# Altium project RTTester_CIV.PrjPcb (part 2 of 2)

## Sheet EEPROM.SchDoc: EEPROM
size A4; DocumentNumber: 5; SheetNumber: 5; SheetTotal: 18
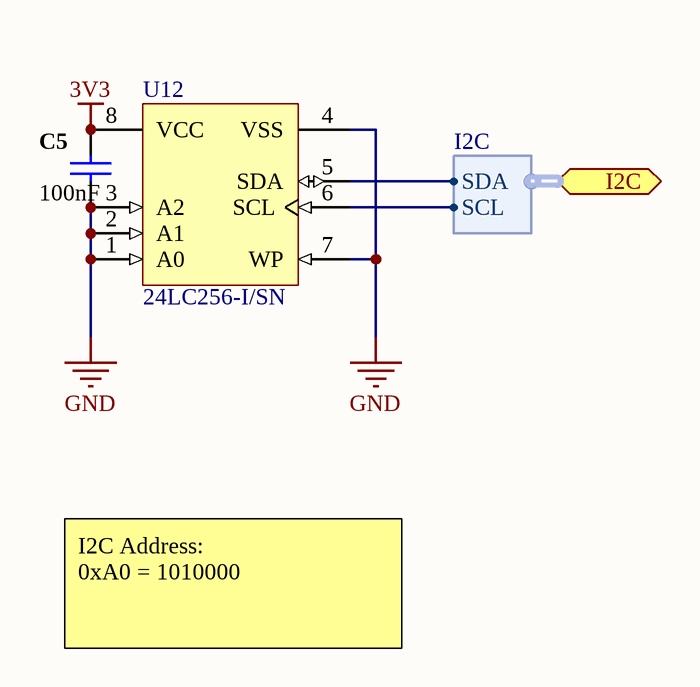
[diagram p17: EEPROM.SchDoc]

### Parts
C5  100nF  [0805C-GENERIC]
U12  24LC256-I/SN  [SOIC-SN8_L]

### Ports
I2C (harness I2C)

### Harnesses
I2C: SDA, SCL

### Nets
3V3: C5.1 U12.8(VCC)
GND: C5.2 U12.1(A0) U12.2(A1) U12.3(A2) U12.4(VSS) U12.7(WP)
FPGA_SCL: U12.6(SCL) ; port I2C.SCL
FPGA_SDA: U12.5(SDA) ; port I2C.SDA

### Notes on the sheet
- I2C Address:
  0xA0 = 1010000
- Title
- Size:
- Date:
- A4
- Number:
- Time:
- Revision:
- Sheet
- of
- File:

### Library data of the parts
C5 = D-101-0027: Capacitor, Ceramic, 10% 10V 0805 X7R; Polarity: Non-Polarized; Capacitance: 100nF; Dielectric: X7R; Mounting Technology: Surface Mount; Rated Voltage: 10 V; Status: Production; Technology: Ceramic; Tolerance: 10 %; Category: Capacitor
U12 = 24LC256-I/SN: 256Kbit, 400kHz, 2.5V, I2C Serial EEPROM, 8-Pin SOIC 150mil, Industrial Temperature; Manufacturer: Microchip; DatasheetVersion: revP, Oct-2007; PackageVersion: revBB, Aug-2009; PackageReference: SOIC-SN8; PackageDescription: 8-Lead Plastic Small Outline (SN) - Narrow, 3.90mm Body [SOIC]; Supplier 1: Digi-Key; Supplier Part Number 1: 24LC256-I/SN-ND; Supplier 2: Farnell; Supplier Part Number 2: 9757996; Supplier 3: Farnell; Supplier Part Number 3: 1660005; Supplier 4: Newark; Supplier Part Number 4: 27C9144; Supplier 5: Mouser; Supplier Part Number 5: 579-24LC256-I/SN; Mounting Technology: Surface Mount; Code_JEDEC: MS-012; Code_IPC: SOIC127P600-8; PartNumber: 24LC256-I/SN; ComponentLink1Description: Manufacturer URL; ComponentLink1URL: http://www.microchip.com/; ComponentLink2Description: Datasheet; ComponentLink2URL: http://ww1.microchip.com/downloads/en/DeviceDoc/21203P.pdf; ComponentLink3Description: Package Specification; ComponentLink3URL: http://www.microchip.com/stellent/groups/techpub_sg/documents/packagingspec/en012702.pdf

## Nets that join several sheets
1V2: PUS_Decoupling (8 pins), PSU_1V2_LD1117A (C31.1 U5.2 U5.4), FPGA_Power (12 pins)
2V5: PUS_Decoupling (L1.1), PSU_2V5_LDK130 (C61.1 U6.5)
3V3: PUS_Decoupling (C33.1 C34.1 C35.1), PSU_3V3_LD29300 (C62.1 U10.4), PSU_1V2_LD1117A (C12.1 U5.3), LEDs_Switches (5 pins), MCU_USB_Interface (9 pins), Connectors (9 pins), Config_Interfaces (8 pins), MicroSD (U9.4), FPGA_Conf (8 pins), FPGA_Power (12 pins), OSC (C3.1 X1.4), EEPROM (C5.1 U12.8)
5V0_RPi: PSU (D3.A D4.A), Connectors (P5.2 P5.4)
5V0_USB: PSU (D1.A D2.A), MCU_USB_Interface (U8.7), Connectors (J6.1)
GND: PUS_Decoupling (17 pins), PSU_3V3_LD29300 (C10.2 C62.2 U10.3 U10.6), PSU_2V5_LDK130 (C59.2 C60.2 C61.2 U6.2), PSU_1V2_LD1117A (C12.2 C31.2 U5.1), LEDs_Switches (11 pins), MCU_USB_Interface (12 pins), Connectors (22 pins), Config_Interfaces (9 pins), MicroSD (U9.6 U9.GND1 U9.GND3), FPGA_Conf (R61.2 U3.96 U4.4), FPGA_CLK (14 pins), FPGA_Power (20 pins), OSC (C3.2 C4.2 X1.2), EEPROM (6 pins)
VCC_EXT: PSU (J5.2), PUS_Decoupling (C6.1 C8.1), PSU_3V3_LD29300 (C10.1 U10.1 U10.2), PSU_2V5_LDK130 (C59.1 U6.1 U6.3), LEDs_Switches (R56.2)
VCC_HDR: PSU (D5.A D6.A), Connectors (P6.1)
VCCA: PUS_Decoupling (C17.2 C42.2 L1.2), FPGA_Power (U3.3 U3.35 U3.75 U3.107)
VCCD_PLL: PUS_Decoupling (C47.2 C48.1 C49.1 L2.2), FPGA_Power (U3.1 U3.37 U3.73 U3.109)
FPGA_CLK: FPGA_CLK (U3.23), OSC (C4.1 X1.3)
FPGA_MISO: Connectors (U11.2), FPGA_Banks (U3.85)
FPGA_MOSI: Connectors (U11.14), FPGA_Banks (U3.86)
FPGA_RX: MCU_USB_Interface (P10#2.1 U8.21), FPGA_Banks (U3.99)
FPGA_SCK: Connectors (U11.11), FPGA_Banks (U3.83)
FPGA_SCL: MCU_USB_Interface (U8.18), Connectors (P5.28 P7.2 R42.2), FPGA_Banks (U3.100), EEPROM (U12.6)
FPGA_SDA: MCU_USB_Interface (U8.19), Connectors (P5.27 P7.1 R41.2), FPGA_Banks (U3.101), EEPROM (U12.5)
FPGA_SS: Connectors (U11.5), FPGA_Banks (U3.87)
FPGA_TX: MCU_USB_Interface (P10#2.2 U8.20), FPGA_Banks (U3.98)
FPGAIO_A2: Connectors (R2.1), FPGA_Banks (U3.77)
FPGAIO_A3: Connectors (R5.1), FPGA_Banks (U3.76)
FPGAIO_A4: Connectors (R37.1), FPGA_Banks (U3.72)
FPGAIO_A5: Connectors (R38.1), FPGA_Banks (U3.71)
FPGAIO_A6: Connectors (R39.1), FPGA_Banks (U3.69)
FPGAIO_A7: Connectors (R14.1), FPGA_Banks (U3.68)
FPGAIO_A8: Connectors (R15.1), FPGA_Banks (U3.67)
FPGAIO_A9: Connectors (R16.1), FPGA_Banks (U3.66)
FPGAIO_A10: Connectors (R17.1), FPGA_Banks (U3.65)
FPGAIO_A11: Connectors (R18.1), FPGA_Banks (U3.64)
FPGAIO_A12: Connectors (R19.1), FPGA_Banks (U3.61)
FPGAIO_A13: Connectors (R20.1), FPGA_Banks (U3.60)
FPGAIO_A14: Connectors (R21.1), FPGA_Banks (U3.59)
FPGAIO_A15: Connectors (R22.1), FPGA_Banks (U3.58)
FPGAIO_A16: Connectors (R23.1), FPGA_Banks (U3.51)
FPGAIO_A17: Connectors (R24.1), FPGA_Banks (U3.50)
FPGAIO_A18: Connectors (R25.1), FPGA_Banks (U3.49)
FPGAIO_A19: Connectors (R26.1), FPGA_Banks (U3.46)
FPGAIO_A20: Connectors (R27.1), FPGA_Banks (U3.44)
FPGAIO_A21: Connectors (R28.1), FPGA_Banks (U3.43)
FPGAIO_A22: Connectors (R29.1), FPGA_Banks (U3.42)
FPGAIO_A23: Connectors (R30.1), FPGA_Banks (U3.39)
FPGAIO_A24: Connectors (R35.1), FPGA_Banks (U3.32)
FPGAIO_A25: Connectors (R36.1), FPGA_Banks (U3.33)
LED0: LEDs_Switches (R3.2), FPGA_Banks (U3.143)
LED1: LEDs_Switches (R4.2), FPGA_Banks (U3.144)
LED2: LEDs_Switches (R6.2), FPGA_Banks (U3.7)
LED3: LEDs_Switches (R7.2), FPGA_Banks (U3.10)
MISO: MCU_USB_Interface (P12.1 U8.11), Connectors (U11.3)
MOSI: MCU_USB_Interface (P12.4 U8.10), Connectors (U11.13)
NetC52_1: Config_Interfaces (C52.1 D10.A P8.1), FPGA_Conf (U3.12 U4.6)
NetC53_1: Config_Interfaces (C53.1 D11.A P8.7), FPGA_Conf (R62.2), FPGA_Banks (U3.13)
NetC54_1: Config_Interfaces (C54.1 D12.A P8.9), FPGA_Conf (U4.5), FPGA_Banks (U3.6)
NetC55_1: Config_Interfaces (C55.1 D13.A P8.8), FPGA_Conf (U4.1), FPGA_Banks (U3.8)
NetJ6_2: MCU_USB_Interface (R49.1), Connectors (J6.2)
NetJ6_3: MCU_USB_Interface (R50.1), Connectors (J6.3)
NetP8_3: LEDs_Switches (U7.1), Config_Interfaces (P8.3), FPGA_Conf (R58.2 U3.92)
NetP8_5: Config_Interfaces (P8.5), FPGA_Conf (R59.2 U3.14)
NetP8_6: Config_Interfaces (P8.6), FPGA_Conf (R61.1 U3.21)
NetR32_2: Config_Interfaces (R32.2 R45.1), FPGA_Conf (U3.20)
NetR33_2: Config_Interfaces (R33.2 R47.1), FPGA_Conf (U3.15)
NetR34_1: Config_Interfaces (R34.1 R44.1), FPGA_Conf (U3.16)
NetR46_1: Config_Interfaces (R46.1), FPGA_Conf (U3.18)
SCK: MCU_USB_Interface (P12.3 U8.9), Connectors (U11.10)
SPI_M/!S: MCU_USB_Interface (U8.12), Connectors (U11.1)
SS: MCU_USB_Interface (U8.8), Connectors (U11.6)
SW0: LEDs_Switches (U7.4), FPGA_Banks (U3.11)
SW1: LEDs_Switches (U7.6), FPGA_Banks (U3.28)
SW2: LEDs_Switches (U7.8), FPGA_Banks (U3.30)
SW3: LEDs_Switches (U7.10), FPGA_Banks (U3.31)
uSD_MISO: Connectors (U11.4), MicroSD (U9.7)
uSD_MOSI: Connectors (U11.12), MicroSD (U9.3)
uSD_SCK: Connectors (U11.9), MicroSD (U9.5)
uSD_SS: Connectors (U11.7), MicroSD (U9.2)